# Altium project New_Thermistor_Board.PrjPcb
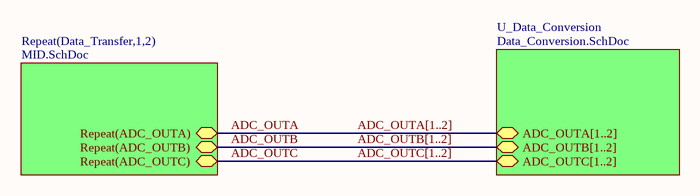
[diagram p0: TOP.SchDoc]
6 sheets, 59 parts. Net scope: hierarchical (ports join the sheet entries above them; power ports are global).
Board file: MUX_Connectivity.PcbDoc
Sheets:
  TOP.SchDoc
    Data_Transfer1 = MID.SchDoc
      U_AHK50H-ND_THERM_CONNECTOR = 50Pin_Connector.SchDoc
      U_Single_Mux = Multiplexers.SchDoc
    Data_Transfer2 = MID.SchDoc
      U_AHK50H-ND_THERM_CONNECTOR = 50Pin_Connector.SchDoc
      U_Single_Mux = Multiplexers.SchDoc
    U_Data_Conversion = Data_Conversion.SchDoc
  3.3V_PS.SchDoc

## Sheet TOP.SchDoc
size A; DocumentNumber: 2; SheetNumber: 2; SheetTotal: 5

### Sub-sheets
Repeat(Data_Transfer,1,2) = MID.SchDoc: Repeat(ADC_OUTA) (bidir), Repeat(ADC_OUTB) (bidir), Repeat(ADC_OUTC) (bidir)
U_Data_Conversion = Data_Conversion.SchDoc: ADC_OUTA[1..2] (bidir), ADC_OUTB[1..2] (bidir), ADC_OUTC[1..2] (bidir)

### Nets
ADC_OUTA: sheet Repeat(Data_Transfer,1,2)/Repeat(ADC_OUTA)
ADC_OUTB: sheet Repeat(Data_Transfer,1,2)/Repeat(ADC_OUTB)
ADC_OUTC: sheet Repeat(Data_Transfer,1,2)/Repeat(ADC_OUTC)

### Buses and harness runs
bus ADC_OUTA[1..2] = sheet U_Data_Conversion/ADC_OUTA[1..2]
bus ADC_OUTB[1..2] = sheet U_Data_Conversion/ADC_OUTB[1..2]
bus ADC_OUTC[1..2] = sheet U_Data_Conversion/ADC_OUTC[1..2]

## Sheet MID.SchDoc
size A
Used 2 times, as channels Data_Transfer1, Data_Transfer2. Parts and nets are listed once, with the designators drawn on the sheet.
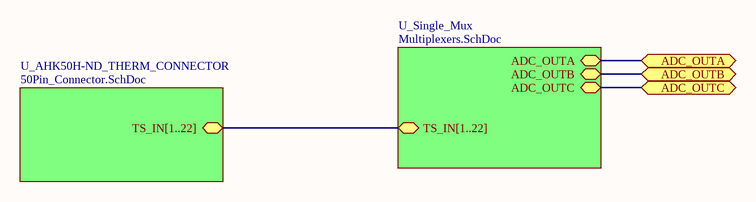
[diagram p1: MID.SchDoc]

### Sub-sheets
U_AHK50H-ND_THERM_CONNECTOR = 50Pin_Connector.SchDoc: TS_IN[1..22]
U_Single_Mux = Multiplexers.SchDoc: ADC_OUTA (bidir), TS_IN[1..22], ADC_OUTB (bidir), ADC_OUTC (bidir)

### Ports
ADC_OUTA (bidir), ADC_OUTB (bidir), ADC_OUTC (bidir)

### Nets
ADC_OUTA: port ADC_OUTA, sheet U_Single_Mux/ADC_OUTA
ADC_OUTB: port ADC_OUTB, sheet U_Single_Mux/ADC_OUTB
ADC_OUTC: port ADC_OUTC, sheet U_Single_Mux/ADC_OUTC

### Channels
Data_Transfer1: ports ADC_OUTA=ADC_OUTA ADC_OUTB=ADC_OUTB ADC_OUTC=ADC_OUTC
Data_Transfer2: ports ADC_OUTA=ADC_OUTA ADC_OUTB=ADC_OUTB ADC_OUTC=ADC_OUTC

### Buses and harness runs
bus sheet U_AHK50H-ND_THERM_CONNECTOR/TS_IN[1..22] = sheet U_Single_Mux/TS_IN[1..22]

## Sheet 50Pin_Connector.SchDoc
size A; DocumentNumber: 1; SheetNumber: 1; SheetTotal: 5
Used 2 times, as channels Data_Transfer1/U_AHK50H-ND_THERM_CONNECTOR, Data_Transfer2/U_AHK50H-ND_THERM_CONNECTOR. Parts and nets are listed once, with the designators drawn on the sheet.
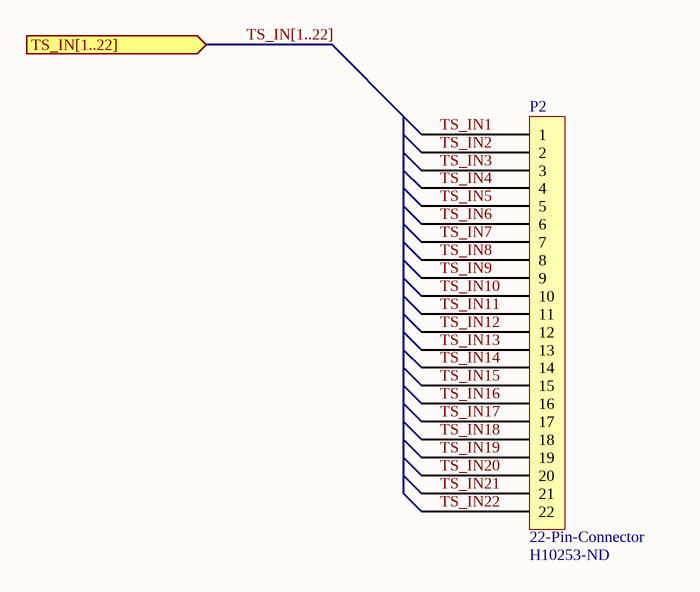
[diagram p2: 50Pin_Connector.SchDoc]

### Parts
P2  22-Pin-Connector  Supplier Part Number 1: H10253-ND  [22-Pin Conenctor]

### Ports
TS_IN[1..22]

### Nets
TS_IN1: P2.1
TS_IN2: P2.2
TS_IN3: P2.3
TS_IN4: P2.4
TS_IN5: P2.5
TS_IN6: P2.6
TS_IN7: P2.7
TS_IN8: P2.8
TS_IN9: P2.9
TS_IN10: P2.10
TS_IN11: P2.11
TS_IN12: P2.12
TS_IN13: P2.13
TS_IN14: P2.14
TS_IN15: P2.15
TS_IN16: P2.16
TS_IN17: P2.17
TS_IN18: P2.18
TS_IN19: P2.19
TS_IN20: P2.20
TS_IN21: P2.21
TS_IN22: P2.22

### Channels
Data_Transfer1/U_AHK50H-ND_THERM_CONNECTOR: designators end in _1
Data_Transfer2/U_AHK50H-ND_THERM_CONNECTOR: designators end in _2

### Buses and harness runs
bus TS_IN[1..22] = port TS_IN[1..22]

### Library data of the parts
P2 = 22-Pin-Connector: Manufacturer: Hirose; Manufacturer Part Number: DF11-22DP-2DS(24); Number of Contacts: 22; Gender: Male; Connector Type: Male Pin; Contact Resistance: 30mR; Max Current Rating: 2A; Voltage Rating: 250V; Pitch: 2mm; Row Spacing: 0.079inch; Supplier 1: Digi-Key; Stock 1: 536; Pricing 1: 1=1.19, 20=1.0455, 100=0.902, 500=0.738, 1000=0.656 (USD); Mount: Through Hole; Contact Plating: Tin; Contact Material: Brass,Copper Alloy,Tin; Color: Black; Housing Color: Black; Housing Material: Polyamide; Min Operating Temperature: -30°C; Max Operating Temperature: 85°C; Number of Rows: 2; Termination: Solder; Packaging: Rail/Tube; Package Quantity: 20; Fastening Type: Detent; Number of Positions: 22; Current Rating: 2A; Orientation: Right Angle; Length: 24mm; Height: 5mm; Contact Mating Length: 0.118inch; Depth: 10mm; Radiation Hardening: No; Lead Free: Lead Free; ComponentLink1URL: http://docs-usa.electrocomponents.com/techlib:/itc_doclist_US.htm?stockno=6888963&src-supplier=Allied+Electronics; ComponentLink1Description: http://docs-usa.electrocomponents.com/techlib:/itc_doclist_US.htm?stockno=6888963&src-supplier=Allied+Electronics; ComponentLink2URL: https://www.verical.com/server-webapp/html/getDatasheet?partID=456315&src-supplier=Verical; ComponentLink2Description: https://www.verical.com/server-webapp/html/getDatasheet?partID=456315&src-supplier=Verical; ComponentLink3URL: http://www.hirose.co.jp/cataloge_hp/en_DF11_20130411.pdf?src-supplier=Future+Electronics; ComponentLink3Description: http://www.hirose.co.jp/cataloge_hp/en_DF11_20130411.pdf?src-supplier=Future+Electronics; ComponentLink4URL: http://www.farnell.com/datasheets/91550.pdf?src-supplier=Element14; ComponentLink4Description: http://www.farnell.com/datasheets/91550.pdf?src-supplier=Element14; ComponentLink5URL: http://www.mouser.com/ds/2/185/DF11_catalog-1064296.pdf?src-supplier=Mouser; ComponentLink5Description: http://www.mouser.com/ds/2/185/DF11_catalog-1064296.pdf?src-supplier=Mouser; ComponentLink6URL: http://documents.rs-components.com/techlib://itc_doclist_GB.htm?stockno=6056598&src-supplier=RSComponents; ComponentLink6Description: http://documents.rs-components.com/techlib://itc_doclist_GB.htm?stockno=6056598&src-supplier=RSComponents

## Sheet Multiplexers.SchDoc
size A; DocumentNumber: 5; SheetNumber: 5; SheetTotal: 5
Used 2 times, as channels Data_Transfer1/U_Single_Mux, Data_Transfer2/U_Single_Mux. Parts and nets are listed once, with the designators drawn on the sheet.
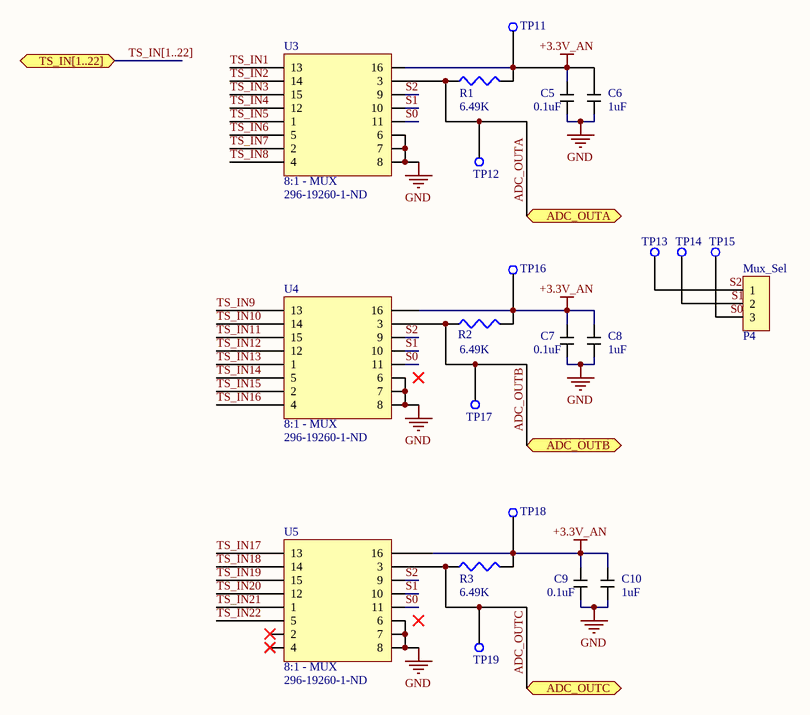
[diagram p3: Multiplexers.SchDoc]

### Parts
C5  0.1uF  [0.1uF_Kemet]
C6  1uF  [1uf_Samsung]
C7  0.1uF  [0.1uF_Kemet]
C8  1uF  [1uf_Samsung]
C9  0.1uF  [0.1uF_Kemet]
C10  1uF  [1uf_Samsung]
P4  Mux_Sel  [3-Screw-terminal-Mux-Select]
R1  Resistance: 6.49K  [RESC2012X06N]  (hidden comment: 6.49kOhm SMD Resistor)
R2  Resistance: 6.49K  [RESC2012X06N]  (hidden comment: 6.49kOhm SMD Resistor)
R3  Resistance: 6.49K  [RESC2012X06N]  (hidden comment: 6.49kOhm SMD Resistor)
TP11  Test Point  [Test Point]  (value not drawn)
TP12  Test Point  [Test Point]  (value not drawn)
TP13  Test Point  [Test Point]  (value not drawn)
TP14  Test Point  [Test Point]  (value not drawn)
TP15  Test Point  [Test Point]  (value not drawn)
TP16  Test Point  [Test Point]  (value not drawn)
TP17  Test Point  [Test Point]  (value not drawn)
TP18  Test Point  [Test Point]  (value not drawn)
TP19  Test Point  [Test Point]  (value not drawn)
U3  8:1 - MUX  Supplier Part Number 1: 296-19260-1-ND  [SOP127P600X175]
U4  8:1 - MUX  Supplier Part Number 1: 296-19260-1-ND  [SOP127P600X175]
U5  8:1 - MUX  Supplier Part Number 1: 296-19260-1-ND  [SOP127P600X175]

### Ports
ADC_OUTA (bidir), ADC_OUTB (bidir), ADC_OUTC (bidir), TS_IN[1..22] (bidir)

### Nets
+3.3V_AN: C5.2 C6.2 C7.2 C8.2 C9.2 C10.2 R1.2 R2.2 R3.2 TP11.1 TP16.1 TP18.1 U3.16 U4.16 U5.16
GND: C5.1 C6.1 C7.1 C8.1 C9.1 C10.1 U3.6 U3.7 U3.8 U4.6 U4.7 U4.8 U5.6 U5.7 U5.8
ADC_OUTA: R1.1 TP12.1 U3.3 ; port ADC_OUTA
ADC_OUTB: R2.1 TP17.1 U4.3 ; port ADC_OUTB
ADC_OUTC: R3.1 TP19.1 U5.3 ; port ADC_OUTC
S0: U3.11 U4.11 U5.11
S1: U3.10 U4.10 U5.10
S2: P4.1 TP13.1 U3.9 U4.9 U5.9
TS_IN1: U3.13
TS_IN2: U3.14
TS_IN3: U3.15
TS_IN4: U3.12
TS_IN5: U3.1
TS_IN6: U3.5
TS_IN7: U3.2
TS_IN8: U3.4
TS_IN9: U4.13
TS_IN10: U4.14
TS_IN11: U4.15
TS_IN12: U4.12
TS_IN13: U4.1
TS_IN14: U4.5
TS_IN15: U4.2
TS_IN16: U4.4
TS_IN17: U5.13
TS_IN18: U5.14
TS_IN19: U5.15
TS_IN20: U5.12
TS_IN21: U5.1
TS_IN22: U5.5
NetP4_2: P4.2 TP14.1
NetP4_3: P4.3 TP15.1

Not connected (* = marked no-connect by the designer): U5 2* 4*

### Channels
Data_Transfer1/U_Single_Mux: designators end in _1; ports ADC_OUTA=ADC_OUTA ADC_OUTB=ADC_OUTB ADC_OUTC=ADC_OUTC
Data_Transfer2/U_Single_Mux: designators end in _2; ports ADC_OUTA=ADC_OUTA ADC_OUTB=ADC_OUTB ADC_OUTC=ADC_OUTC

### Buses and harness runs
bus TS_IN[1..22] = port TS_IN[1..22]

### Notes on the sheet
- Labels drawn without touching a wire or pin: S0, S1

### Library data of the parts
C5 C7 C9 = 0.1uF Cap: C0603C101K8GAC7867 Kemet Capacitor; Supplier 1: Digi-Key; Supplier Part Number 1: 399-14477-1-ND
C6 C8 C10 = 1uF Samsung Cap: Supplier 1: Digi-Key; Supplier Part Number 1: 1276-1946-1-ND
P4 = 3-Screw-Terminal-Mux-Select: Mux Select; Manufacturer: Wurth Electronics; Manufacturer Part Number: 691103110003; Voltage Rating: 125V; Current Rating: 10A; Number of Levels: 1; Number of Positions Per Level: 3; Wire/Cable Gauge: 26AWG; Pitch: 0.138inch; Stripping Length: -6mm; Supplier 1: Digi-Key; Stock 1: 617; Pricing 1: 1=1.1, 10=0.986, 50=0.851, 100=0.762, 500=0.717, 980=0.672 (USD); Contact Material: Brass; Color: Blue; Housing Material: Nylon; Number of Contacts: 3; Termination: Screw; Length: 7mm; Height: 12.2mm; Width: 11.5mm; REACH SVHC: Unknown; ComponentLink1URL: http://www.farnell.com/datasheets/1442217.pdf?src-supplier=Element14; ComponentLink1Description: http://www.farnell.com/datasheets/1442217.pdf?src-supplier=Element14; Supplier Part Number 1: 732-2746-ND
R1-R3 = 6.49kOhm SMD Resistor: Manufacturer: Panasonic; Manufacturer Part Number: ERA6AEB6491V; Tolerance: 0.1%; Temperature Coefficient: 25ppm/°C; Power Rating: 125mW; Voltage Rating: 100V; Supplier 1: Digi-Key; Stock 1: 15147; Pricing 1: 1=0.36, 10=0.302, 100=0.1182, 1000=0.0495, 2500=0.0454 (USD); Mount: Surface Mount; Case/Package: 0805; Number of Pins: 2; Contact Plating: Tin; Case Code (Metric): 2012; Case Code (Imperial): 0805; Min Operating Temperature: -55°C; Max Operating Temperature: 155°C; Composition: Thin Film,Metal Film; Packaging: Tape and Reel; Package Quantity: 1; Number of Terminations: 2; Termination: SMD/SMT; Military Standard: Not; Max Power Dissipation: 125mW; Voltage Rating (DC): 100V; Features: Automotive AEC-Q200; Length: 2mm; Height: 0.5mm; Width: 1.25mm; Depth: 1.25mm; Radiation Hardening: No; REACH SVHC: No SVHC; Lead Free: Lead Free; ComponentLink1URL: http://www.farnell.com/datasheets/485442.pdf?src-supplier=Farnell; ComponentLink1Description: http://www.farnell.com/datasheets/485442.pdf?src-supplier=Farnell; ComponentLink2URL: http://www.mouser.com/ds/2/315/AOA0000CE26-32660.pdf?src-supplier=Mouser; ComponentLink2Description: http://www.mouser.com/ds/2/315/AOA0000CE26-32660.pdf?src-supplier=Mouser; ComponentLink3URL: http://www.farnell.com/datasheets/2059650.pdf?src-supplier=Farnell; ComponentLink3Description: http://www.farnell.com/datasheets/2059650.pdf?src-supplier=Farnell; ComponentLink4URL: http://uk.rs-online.com/webdocs/0eb1/0900766b80eb1d8c.pdf?src-supplier=RSComponents; ComponentLink4Description: http://uk.rs-online.com/webdocs/0eb1/0900766b80eb1d8c.pdf?src-supplier=RSComponents; ComponentLink5URL: http://www.farnell.com/datasheets/485442.pdf?src-supplier=Element14; ComponentLink5Description: http://www.farnell.com/datasheets/485442.pdf?src-supplier=Element14; ComponentLink6URL: http://www.produktinfo.conrad.com/datenblaetter/1100000-1199999/001181295-da-01-en-WIDERSTAND_ERA_0805_6K49_0_1__5000ST.pdf?src-supplier=Conrad; ComponentLink6Description: http://www.produktinfo.conrad.com/datenblaetter/1100000-1199999/001181295-da-01-en-WIDERSTAND_ERA_0805_6K49_0_1__5000ST.pdf?src-supplier=Conrad; Supplier Part Number 1: P6.49KDACT-ND
U3-U5 = 8:1 - MUX: Manufacturer: Texas Instruments; Manufacturer Part Number: SN74LV4051ATPWRQ1; Max Supply Voltage: 5.5V; Min Supply Voltage: 2V; Bandwidth: 35MHz; Propagation Delay: 7ns; Number of Channels: 1; Number of Inputs: 8; Logic Function: Multiplexer,Demultiplexer; On-State Resistance: 75R; Operating Supply Current: 20uA; Turn-On Delay Time: 20ns; Supply Type: Single; High Level Output Current: 25mA; Supplier 1: Digi-Key; Stock 1: 41099; Pricing 1: 1=0.73, 10=0.646, 100=0.4951, 500=0.3914, 1000=0.3131 (USD); Mount: Surface Mount; Case/Package: TSSOP; Number of Pins: 16; Weight: 0.002169oz; Contact Plating: Gold; Min Operating Temperature: -40°C; Max Operating Temperature: 105°C; Package Quantity: 1; Packaging: Tape and Reel; Number of Outputs: 1; Turn-Off Delay Time: 20ns; Number of Circuits: 1; Number of Bits: 8; Low Level Output Current: 25mA; Radiation Hardening: No; REACH SVHC: No SVHC; Lead Free: Lead Free; ComponentLink1URL: http://www.ti.com/lit/ds/symlink/sn74lv4051a-q1.pdf?src-supplier=Digi-Key; ComponentLink1Description: http://www.ti.com/lit/ds/symlink/sn74lv4051a-q1.pdf?src-supplier=Digi-Key; ComponentLink2URL: http://www.ti.com/lit/gpn/sn74lv4051a-q1?src-supplier=Mouser; ComponentLink2Description: http://www.ti.com/lit/gpn/sn74lv4051a-q1?src-supplier=Mouser; ComponentLink3URL: https://www.verical.com/server-webapp/html/getDatasheet?partID=137249&src-supplier=Verical; ComponentLink3Description: https://www.verical.com/server-webapp/html/getDatasheet?partID=137249&src-supplier=Verical; ComponentLink4URL: http://focus.ti.com/lit/ds/symlink/sn74lv4051a-q1.pdf?src-supplier=Avnet; ComponentLink4Description: http://focus.ti.com/lit/ds/symlink/sn74lv4051a-q1.pdf?src-supplier=Avnet; ComponentLink5URL: http://www.produktinfo.conrad.com/datenblaetter/1100000-1199999/001187277-da-01-en-IC_MUX_DE_SN74LV4051ATPWRQ1_TSSOP_16_TID.pdf?src-supplier=Conrad; ComponentLink5Description: http://www.produktinfo.conrad.com/datenblaetter/1100000-1199999/001187277-da-01-en-IC_MUX_DE_SN74LV4051ATPWRQ1_TSSOP_16_TID.pdf?src-supplier=Conrad

## Sheet Data_Conversion.SchDoc
size A; DocumentNumber: 4; SheetNumber: 4; SheetTotal: 5
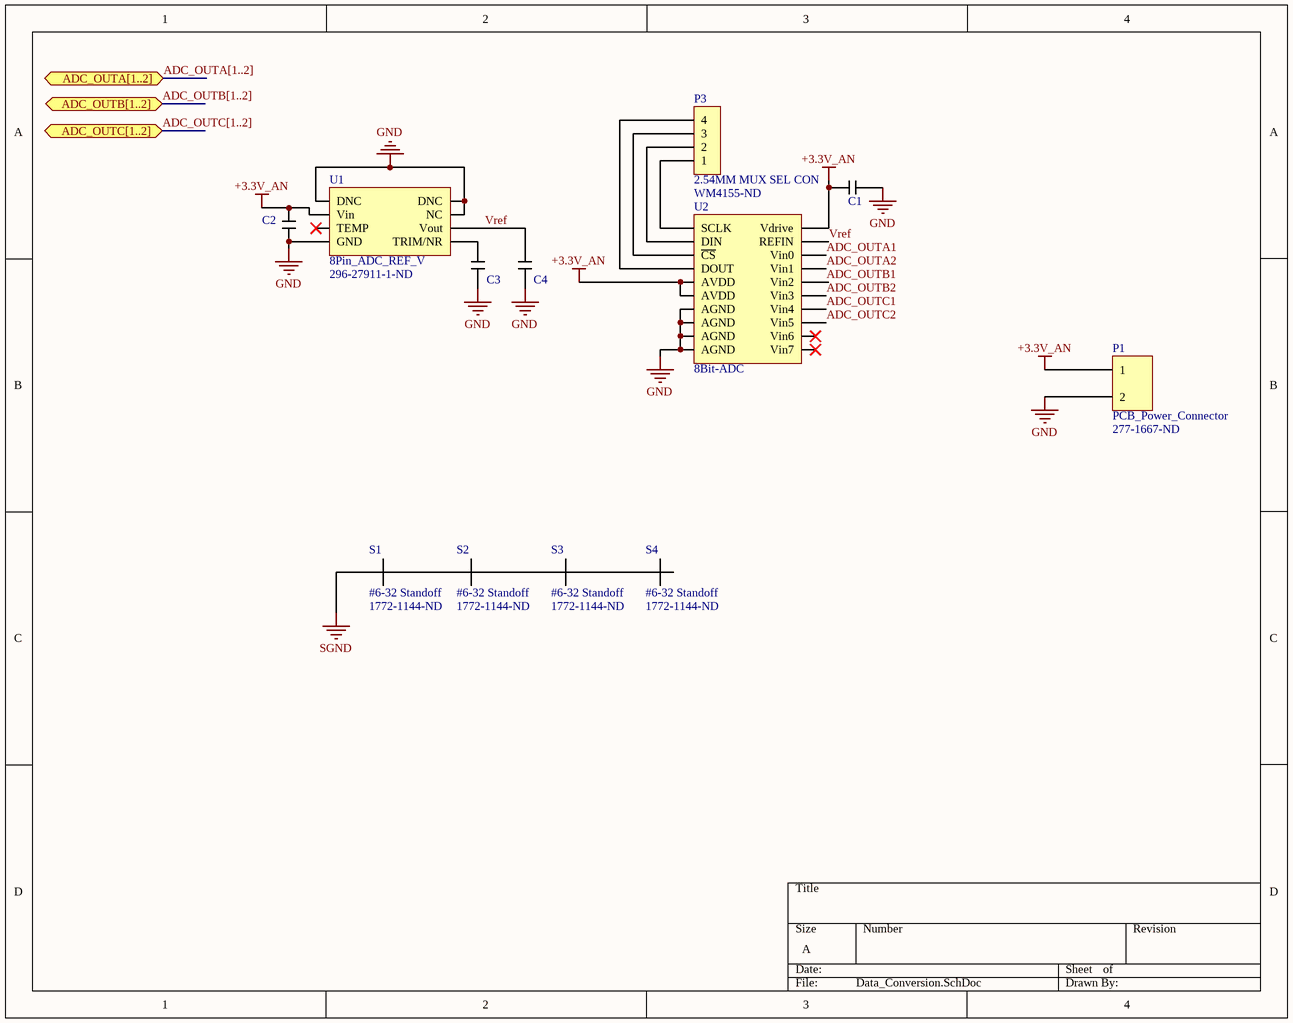
[diagram p4: Data_Conversion.SchDoc]

### Parts
(Parts that share a designator on the sheet are numbered #1, #2 ... from top to bottom, then left to right.)
C1  0.1uF Cap  [0.1uF_Kemet]  (value not drawn)
C2  0.1uF Cap  [0.1uF_Kemet]  (value not drawn)
C3  0.1uF Cap  [0.1uF_Kemet]  (value not drawn)
C4  0.1uF Cap  [0.1uF_Kemet]  (value not drawn)
P1#1  PCB_Power_Connector  Supplier Part Number 1: 277-1667-ND  [Power_Connector]
P3  2.54MM MUX SEL CON  Supplier Part Number 1: WM4155-ND  [4POS 2.54MM HEADER MUX SEL]
S1  #6-32 Standoff  Supplier Part Number 1: 1772-1144-ND  [#6-32 Stand Off]
S2  #6-32 Standoff  Supplier Part Number 1: 1772-1144-ND  [#6-32 Stand Off]
S3  #6-32 Standoff  Supplier Part Number 1: 1772-1144-ND  [#6-32 Stand Off]
S4  #6-32 Standoff  Supplier Part Number 1: 1772-1144-ND  [#6-32 Stand Off]
U1  8Pin_ADC_REF_V  Supplier Part Number 1: 296-27911-1-ND  [SOIC127P600X175-8N]
U2  8Bit-ADC  [8Bit-8Ch-SAR-ADC]

### Ports
ADC_OUTA[1..2] (bidir), ADC_OUTB[1..2] (bidir), ADC_OUTC[1..2] (bidir)

### Nets
+3.3V_AN: C1.2 C2.2 P1#1.1 U1.2(Vin) U2.5(AVDD) U2.6(AVDD) U2.19(Vdrive)
GND: C1.1 C2.1 C3.2 C4.1 P1#1.2 U1.1(DNC) U1.4(GND) U1.7(NC) U1.8(DNC) U2.4(AGND) U2.8(AGND) U2.17(AGND) U2.20(AGND)
ADC_OUTA1: U2.16(Vin0)  [project net ADC_OUTA]
ADC_OUTA2: U2.15(Vin1)  [project net ADC_OUTA]
ADC_OUTB1: U2.14(Vin2)  [project net ADC_OUTB]
ADC_OUTB2: U2.13(Vin3)  [project net ADC_OUTB]
ADC_OUTC1: U2.12(Vin4)  [project net ADC_OUTC]
ADC_OUTC2: U2.11(Vin5)  [project net ADC_OUTC]
Vref: C4.2 U1.6(Vout) U2.7(REFIN)
NetC3_1: C3.1 U1.5(TRIM/NR)
NetP3_1: P3.1 U2.1(SCLK)
NetP3_2: P3.2 U2.2(DIN)
NetP3_3: P3.3 U2.3(~{CS})
NetP3_4: P3.4 U2.18(DOUT)

Not connected (* = marked no-connect by the designer): U1 3(TEMP)*; U2 9(Vin7)* 10(Vin6)*

### Buses and harness runs
bus ADC_OUTA[1..2] = port ADC_OUTA[1..2]
bus ADC_OUTB[1..2] = port ADC_OUTB[1..2]
bus ADC_OUTC[1..2] = port ADC_OUTC[1..2]

### Library data of the parts
C1-C4 = 0.1uF Cap: C0603C101K8GAC7867 Kemet Capacitor; Supplier 1: Digi-Key; Supplier Part Number 1: 399-14477-1-ND
P1#1 = PCB_Power_Connector: Manufacturer: Phoenix Contact; Manufacturer Part Number: PT1,5/2-5.0-H; Max Current Rating: 16A; Max Supply Voltage: 250V; Current Rating: 17.5A; Number of Poles: 2; Number of Levels: 1; Current: 18A; Voltage: 300V; Voltage Rating (DC): 320V; Connector Type: Screw; Wire Gauge (Max): 26AWG; Wire Gauge (Min): 12AWG; Pitch: 5mm; Wire/Cable Gauge: 14AWG; Approvals: UL; Supplier 1: Digi-Key; Stock 1: 104404; Pricing 1: 1=0.43, 10=0.411, 50=0.3928, 100=0.382, 250=0.357, 500=0.3284, 1000=0.3035 (USD); Mount: Through Hole; Number of Pins: 2; Weight: 0.067021oz; Color: Green; Material: Nylon; Housing Color: Green; Housing Material: Polyamide; Insulation Material: Nylon; Contact Material: Copper,Tin; Number of Rows: 1; Voltage Rating: 250V; Package Quantity: 250; Packaging: Bulk; Number of Positions: 2; Number of Positions Per Level: 2; Termination: Solder; Number of Contacts: 2; Number of Circuits: 2; Orientation: Straight; Length: 9mm; Height: 11.3mm; Width: 14.9mm; Depth: 9mm; Radiation Hardening: No; Lead Free: Lead Free; Flammability Rating: UL94 V-0; ComponentLink1URL: https://media.digikey.com/pdf/Data%20Sheets/Phoenix%20Contact%20PDFs/1935161.pdf; ComponentLink1Description: https://media.digikey.com/pdf/Data%20Sheets/Phoenix%20Contact%20PDFs/1935161.pdf; ComponentLink2URL: https://www.verical.com/server-webapp/html/getDatasheet?partID=177903; ComponentLink2Description: https://www.verical.com/server-webapp/html/getDatasheet?partID=177903
P3 = 2.54MM MUX SEL CON: Manufacturer: Molex; Manufacturer Part Number: 0705530108; Contact Resistance: 30mR; Number of Positions: 4; Connector Type: Male Pin; Pitch: 0.1inch; Voltage Rating: 250V; Current Rating: 3A; Gender: Male; Insulation Resistance: 1GR; Glow Wire Compliant: Non-compliant; Supplier 1: Digi-Key; Stock 1: 1281; Mount: Through Hole; Contact Plating: Gold; Contact Material: Bronze; Housing Material: Polyester; Color: Black; Housing Color: Black; Min Operating Temperature: -40°C; Max Operating Temperature: 105°C; Number of Rows: 1; Packaging: Rail/Tube; Termination: Solder; Orientation: Right Angle; Fastening Type: Latch; Length: 12.71mm; Contact Mating Length: 0.24inch; Depth: 13.59mm; Radiation Hardening: No; ComponentLink1URL: https://www.molex.com/pdm_docs/ps/PS-70400.pdf?src-supplier=Digi-Key; ComponentLink1Description: https://www.molex.com/pdm_docs/ps/PS-70400.pdf?src-supplier=Digi-Key; ComponentLink2URL: http://www.molex.com/webdocs/datasheets/pdf/en-us/0705530108_PCB_HEADERS.pdf?src-supplier=Avnet+Asia; ComponentLink2Description: http://www.molex.com/webdocs/datasheets/pdf/en-us/0705530108_PCB_HEADERS.pdf?src-supplier=Avnet+Asia; Pricing 1: 1=2.03, 10=1.838, 100=1.575, 500=1.3125, 1680=1.0875, 5040=0.9975, 10080=0.975 (USD); Material: Brass; Package Quantity: 1680; Number of Contacts: 4; Voltage Rating (DC): 250V; Number of Circuits: 4; REACH SVHC: Unknown; ELV: Compliant; Flammability Rating: UL94 V-0; ComponentLink3URL: http://www.farnell.com/datasheets/2027073.pdf?src-supplier=Element14; ComponentLink3Description: http://www.farnell.com/datasheets/2027073.pdf?src-supplier=Element14; ComponentLink4URL: http://www.molex.com/webdocs/datasheets/pdf/en-us/0705530108_PCB_HEADERS.pdf?src-supplier=Avnet; ComponentLink4Description: http://www.molex.com/webdocs/datasheets/pdf/en-us/0705530108_PCB_HEADERS.pdf?src-supplier=Avnet; ComponentLink5URL: http://www.mouser.com/ds/2/276/0705530108_PCB_HEADERS-172949.pdf?src-supplier=Mouser; ComponentLink5Description: http://www.mouser.com/ds/2/276/0705530108_PCB_HEADERS-172949.pdf?src-supplier=Mouser
S1-S4 = #6-32 Standoff: Manufacturer: RAF; Manufacturer Part Number: 2102T-632-AL-7; Supplier 1: Digi-Key; Stock 1: 1687; Pricing 1: 1=0.5, 25=0.3328, 100=0.2834, 250=0.2692, 500=0.2551, 1000=0.2409 (USD); Package Quantity: 100
U1 = 8Pin_ADC_REF_V: Manufacturer: Texas Instruments; Manufacturer Part Number: REF5025AQDRQ1; Max Input Voltage: 18V; Output Voltage: 2.5V; Min Input Voltage: 2.7V; Nominal Supply Current: 800uA; Tolerance: 0.1%; Max Output Current: 10mA; Operating Supply Current: 1.2mA; Temperature Coefficient: 3ppm/°C; Reference Type: Series; Output Type: Fixed; Number of Channels: 1; Description: IC VREF SERIES 3V 8SOIC; Case/Package: D; Number of Pins: 8; Weight: 0.002677oz; Min Operating Temperature: -40°C; Max Operating Temperature: 125°C; Packaging: Tape and Reel; Package Quantity: 1; Min Output Voltage: 2.5V; Output Current: 10mA; Max Output Voltage: 2.5V; Quiescent Current: 800uA; Radiation Hardening: No; Lead Free: Lead Free; ComponentLink1URL: http://www.ti.com/lit/ds/symlink/ref5025a-q1.pdf; ComponentLink1Description: http://www.ti.com/lit/ds/symlink/ref5025a-q1.pdf; Supplier 1: Digi-Key; Stock 1: 16802; Pricing 1: 1=3.54, 10=3.182, 100=2.607, 500=2.2193, 1000=1.8717 (USD); ComponentLink2URL: http://www.ti.com/lit/ds/symlink/ref5020a-q1.pdf?src-supplier=Digi-Key; ComponentLink2Description: http://www.ti.com/lit/ds/symlink/ref5020a-q1.pdf?src-supplier=Digi-Key; ComponentLink3URL: http://www.ti.com/lit/ds/symlink/ref5030a-q1.pdf?src-supplier=Digi-Key; ComponentLink3Description: http://www.ti.com/lit/ds/symlink/ref5030a-q1.pdf?src-supplier=Digi-Key
U2 = 8Bit-8Ch-SAR-ADC: Manufacturer: Analog Devices; Manufacturer Part Number: AD7908WYRUZ-REEL7; Max Power Dissipation: 13.5mW; Number of Channels: 8; Interface: SPI; Sampling Rate: 1MS/s; Number of A/D Converters: 1; Resolution: 8b; Signal to Noise Ratio (SNR): 49dB; Input Capacitance: 20pF; Max Input Voltage: 2.525V; Min Input Voltage: 2.475V; Supplier 1: Digi-Key; Stock 1: 1000; Pricing 1: 1=5.68, 10=5.1, 100=4.1789 (USD); Case/Package: TSSOP; Number of Pins: 20; Min Operating Temperature: -40°C; Max Operating Temperature: 85°C; Package Quantity: 1000; Packaging: Tape and Reel; Number of Bits: 8; Number of Inputs: 8; Power Dissipation: 13.5mW; Radiation Hardening: No; Lead Free: Contains Lead; ComponentLink1URL: http://www.analog.com/media/en/technical-documentation/data-sheets/AD7908_7918_7928.pdf?src-supplier=Digi-Key; ComponentLink1Description: http://www.analog.com/media/en/technical-documentation/data-sheets/AD7908_7918_7928.pdf?src-supplier=Digi-Key; ComponentLink2URL: http://www.produktinfo.conrad.com/datenblaetter/1200000-1299999/001245580-da-01-en-IC_ADC_8B_AD7908WYRUZ_REEL7_TSSOP_20_ADI.pdf?src-supplier=Conrad; ComponentLink2Description: http://www.produktinfo.conrad.com/datenblaetter/1200000-1299999/001245580-da-01-en-IC_ADC_8B_AD7908WYRUZ_REEL7_TSSOP_20_ADI.pdf?src-supplier=Conrad; Supplier Part Number 1: AD7908WYRUZ-REEL7CT-ND

## Sheet 3.3V_PS.SchDoc
size A
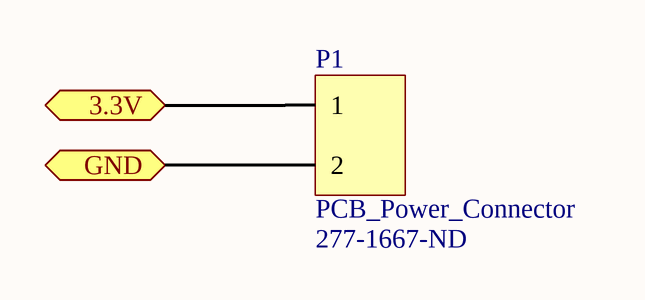
[diagram p5: 3.3V_PS.SchDoc]

### Parts
(Parts that share a designator on the sheet are numbered #1, #2 ... from top to bottom, then left to right.)
P1#2  PCB_Power_Connector  Supplier Part Number 1: 277-1667-ND  [Power_Connector]

### Ports
3.3V (bidir), GND (bidir)

### Nets
NetP1#2_1: P1#2.1 ; port 3.3V
NetP1#2_2: P1#2.2 ; port GND

### Library data of the parts
P1#2 = PCB_Power_Connector: as P1#1 on sheet Data_Conversion; Supplier 1: Digi-Key; Stock 1: 104404; Pricing 1: 1=0.43, 10=0.411, 50=0.3928, 100=0.382, 250=0.357, 500=0.3284, 1000=0.3035 (USD); Mount: Through Hole; Number of Pins: 2; Weight: 0.067021oz; Color: Green; Material: Nylon; Housing Color: Green; Housing Material: Polyamide; Insulation Material: Nylon; Contact Material: Copper,Tin; Number of Rows: 1; Voltage Rating: 250V; Package Quantity: 250; Packaging: Bulk; Number of Positions: 2; Number of Positions Per Level: 2; Termination: Solder; Number of Contacts: 2; Number of Circuits: 2; Orientation: Straight; Length: 9mm; Height: 11.3mm; Width: 14.9mm; Depth: 9mm; Radiation Hardening: No; Lead Free: Lead Free; Flammability Rating: UL94 V-0; ComponentLink1URL: https://media.digikey.com/pdf/Data%20Sheets/Phoenix%20Contact%20PDFs/1935161.pdf; ComponentLink1Description: https://media.digikey.com/pdf/Data%20Sheets/Phoenix%20Contact%20PDFs/1935161.pdf; ComponentLink2URL: https://www.verical.com/server-webapp/html/getDatasheet?partID=177903; ComponentLink2Description: https://www.verical.com/server-webapp/html/getDatasheet?partID=177903

## Nets that join several sheets
+3.3V_AN: Data_Transfer1/U_Single_Mux (15 pins), Data_Transfer2/U_Single_Mux (15 pins), Data_Conversion (7 pins)
GND: Data_Transfer1/U_Single_Mux (15 pins), Data_Transfer2/U_Single_Mux (15 pins), Data_Conversion (13 pins)
ADC_OUTA: Data_Transfer1/U_Single_Mux (R1_1.1 TP12_1.1 U3_1.3), Data_Conversion (U2.16)
ADC_OUTA: Data_Transfer2/U_Single_Mux (R1_2.1 TP12_2.1 U3_2.3), Data_Conversion (U2.15)
ADC_OUTB: Data_Transfer1/U_Single_Mux (R2_1.1 TP17_1.1 U4_1.3), Data_Conversion (U2.14)
ADC_OUTB: Data_Transfer2/U_Single_Mux (R2_2.1 TP17_2.1 U4_2.3), Data_Conversion (U2.13)
ADC_OUTC: Data_Transfer1/U_Single_Mux (R3_1.1 TP19_1.1 U5_1.3), Data_Conversion (U2.12)
ADC_OUTC: Data_Transfer2/U_Single_Mux (R3_2.1 TP19_2.1 U5_2.3), Data_Conversion (U2.11)
TS_IN1: Data_Transfer1/U_AHK50H-ND_THERM_CONNECTOR (P2_1.1), Data_Transfer1/U_Single_Mux (U3_1.13)
TS_IN1: Data_Transfer2/U_AHK50H-ND_THERM_CONNECTOR (P2_2.1), Data_Transfer2/U_Single_Mux (U3_2.13)
TS_IN2: Data_Transfer1/U_AHK50H-ND_THERM_CONNECTOR (P2_1.2), Data_Transfer1/U_Single_Mux (U3_1.14)
TS_IN2: Data_Transfer2/U_AHK50H-ND_THERM_CONNECTOR (P2_2.2), Data_Transfer2/U_Single_Mux (U3_2.14)
TS_IN3: Data_Transfer1/U_AHK50H-ND_THERM_CONNECTOR (P2_1.3), Data_Transfer1/U_Single_Mux (U3_1.15)
TS_IN3: Data_Transfer2/U_AHK50H-ND_THERM_CONNECTOR (P2_2.3), Data_Transfer2/U_Single_Mux (U3_2.15)
TS_IN4: Data_Transfer1/U_AHK50H-ND_THERM_CONNECTOR (P2_1.4), Data_Transfer1/U_Single_Mux (U3_1.12)
TS_IN4: Data_Transfer2/U_AHK50H-ND_THERM_CONNECTOR (P2_2.4), Data_Transfer2/U_Single_Mux (U3_2.12)
TS_IN5: Data_Transfer1/U_AHK50H-ND_THERM_CONNECTOR (P2_1.5), Data_Transfer1/U_Single_Mux (U3_1.1)
TS_IN5: Data_Transfer2/U_AHK50H-ND_THERM_CONNECTOR (P2_2.5), Data_Transfer2/U_Single_Mux (U3_2.1)
TS_IN6: Data_Transfer1/U_AHK50H-ND_THERM_CONNECTOR (P2_1.6), Data_Transfer1/U_Single_Mux (U3_1.5)
TS_IN6: Data_Transfer2/U_AHK50H-ND_THERM_CONNECTOR (P2_2.6), Data_Transfer2/U_Single_Mux (U3_2.5)
TS_IN7: Data_Transfer1/U_AHK50H-ND_THERM_CONNECTOR (P2_1.7), Data_Transfer1/U_Single_Mux (U3_1.2)
TS_IN7: Data_Transfer2/U_AHK50H-ND_THERM_CONNECTOR (P2_2.7), Data_Transfer2/U_Single_Mux (U3_2.2)
TS_IN8: Data_Transfer1/U_AHK50H-ND_THERM_CONNECTOR (P2_1.8), Data_Transfer1/U_Single_Mux (U3_1.4)
TS_IN8: Data_Transfer2/U_AHK50H-ND_THERM_CONNECTOR (P2_2.8), Data_Transfer2/U_Single_Mux (U3_2.4)
TS_IN9: Data_Transfer1/U_AHK50H-ND_THERM_CONNECTOR (P2_1.9), Data_Transfer1/U_Single_Mux (U4_1.13)
TS_IN9: Data_Transfer2/U_AHK50H-ND_THERM_CONNECTOR (P2_2.9), Data_Transfer2/U_Single_Mux (U4_2.13)
TS_IN10: Data_Transfer1/U_AHK50H-ND_THERM_CONNECTOR (P2_1.10), Data_Transfer1/U_Single_Mux (U4_1.14)
TS_IN10: Data_Transfer2/U_AHK50H-ND_THERM_CONNECTOR (P2_2.10), Data_Transfer2/U_Single_Mux (U4_2.14)
TS_IN11: Data_Transfer1/U_AHK50H-ND_THERM_CONNECTOR (P2_1.11), Data_Transfer1/U_Single_Mux (U4_1.15)
TS_IN11: Data_Transfer2/U_AHK50H-ND_THERM_CONNECTOR (P2_2.11), Data_Transfer2/U_Single_Mux (U4_2.15)
TS_IN12: Data_Transfer1/U_AHK50H-ND_THERM_CONNECTOR (P2_1.12), Data_Transfer1/U_Single_Mux (U4_1.12)
TS_IN12: Data_Transfer2/U_AHK50H-ND_THERM_CONNECTOR (P2_2.12), Data_Transfer2/U_Single_Mux (U4_2.12)
TS_IN13: Data_Transfer1/U_AHK50H-ND_THERM_CONNECTOR (P2_1.13), Data_Transfer1/U_Single_Mux (U4_1.1)
TS_IN13: Data_Transfer2/U_AHK50H-ND_THERM_CONNECTOR (P2_2.13), Data_Transfer2/U_Single_Mux (U4_2.1)
TS_IN14: Data_Transfer1/U_AHK50H-ND_THERM_CONNECTOR (P2_1.14), Data_Transfer1/U_Single_Mux (U4_1.5)
TS_IN14: Data_Transfer2/U_AHK50H-ND_THERM_CONNECTOR (P2_2.14), Data_Transfer2/U_Single_Mux (U4_2.5)
TS_IN15: Data_Transfer1/U_AHK50H-ND_THERM_CONNECTOR (P2_1.15), Data_Transfer1/U_Single_Mux (U4_1.2)
TS_IN15: Data_Transfer2/U_AHK50H-ND_THERM_CONNECTOR (P2_2.15), Data_Transfer2/U_Single_Mux (U4_2.2)
TS_IN16: Data_Transfer1/U_AHK50H-ND_THERM_CONNECTOR (P2_1.16), Data_Transfer1/U_Single_Mux (U4_1.4)
TS_IN16: Data_Transfer2/U_AHK50H-ND_THERM_CONNECTOR (P2_2.16), Data_Transfer2/U_Single_Mux (U4_2.4)
TS_IN17: Data_Transfer1/U_AHK50H-ND_THERM_CONNECTOR (P2_1.17), Data_Transfer1/U_Single_Mux (U5_1.13)
TS_IN17: Data_Transfer2/U_AHK50H-ND_THERM_CONNECTOR (P2_2.17), Data_Transfer2/U_Single_Mux (U5_2.13)
TS_IN18: Data_Transfer1/U_AHK50H-ND_THERM_CONNECTOR (P2_1.18), Data_Transfer1/U_Single_Mux (U5_1.14)
TS_IN18: Data_Transfer2/U_AHK50H-ND_THERM_CONNECTOR (P2_2.18), Data_Transfer2/U_Single_Mux (U5_2.14)
TS_IN19: Data_Transfer1/U_AHK50H-ND_THERM_CONNECTOR (P2_1.19), Data_Transfer1/U_Single_Mux (U5_1.15)
TS_IN19: Data_Transfer2/U_AHK50H-ND_THERM_CONNECTOR (P2_2.19), Data_Transfer2/U_Single_Mux (U5_2.15)
TS_IN20: Data_Transfer1/U_AHK50H-ND_THERM_CONNECTOR (P2_1.20), Data_Transfer1/U_Single_Mux (U5_1.12)
TS_IN20: Data_Transfer2/U_AHK50H-ND_THERM_CONNECTOR (P2_2.20), Data_Transfer2/U_Single_Mux (U5_2.12)
TS_IN21: Data_Transfer1/U_AHK50H-ND_THERM_CONNECTOR (P2_1.21), Data_Transfer1/U_Single_Mux (U5_1.1)
TS_IN21: Data_Transfer2/U_AHK50H-ND_THERM_CONNECTOR (P2_2.21), Data_Transfer2/U_Single_Mux (U5_2.1)
TS_IN22: Data_Transfer1/U_AHK50H-ND_THERM_CONNECTOR (P2_1.22), Data_Transfer1/U_Single_Mux (U5_1.5)
TS_IN22: Data_Transfer2/U_AHK50H-ND_THERM_CONNECTOR (P2_2.22), Data_Transfer2/U_Single_Mux (U5_2.5)